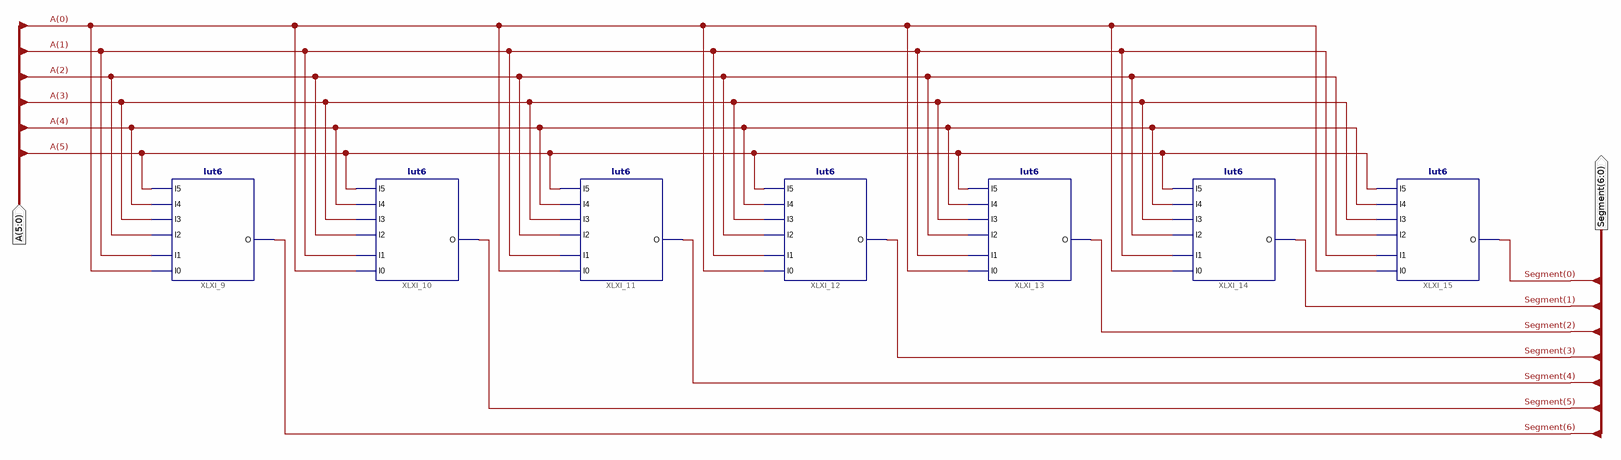
[diagram p0: schematic sheet 1]
// Xilinx ISE schematic ssd1da9tb.sch (spartan6) as structural Verilog: 7 symbols, 2 ports
module ssd1da9tb (
  input  [5:0] A,
  output [6:0] Segment
);

  lut6 #(.INIT("0000000DF38D84FB")) XLXI_9 (
    .O(Segment[6]), .I0(A[0]), .I1(A[1]), .I2(A[2]), .I3(A[3]), .I5(A[5]), .I4(A[4]));
  lut6 #(.INIT("0000000DC55FECF7")) XLXI_10 (
    .O(Segment[5]), .I0(A[0]), .I1(A[1]), .I2(A[2]), .I3(A[3]), .I5(A[5]), .I4(A[4]));
  lut6 #(.INIT("00000005163AFCBF")) XLXI_11 (
    .O(Segment[4]), .I0(A[0]), .I1(A[1]), .I2(A[2]), .I3(A[3]), .I5(A[5]), .I4(A[4]));
  lut6 #(.INIT("0000000DB77C4A5E")) XLXI_12 (
    .O(Segment[3]), .I0(A[0]), .I1(A[1]), .I2(A[2]), .I3(A[3]), .I5(A[5]), .I4(A[4]));
  lut6 #(.INIT("0000000FEDB573CB")) XLXI_13 (
    .O(Segment[2]), .I0(A[0]), .I1(A[1]), .I2(A[2]), .I3(A[3]), .I5(A[5]), .I4(A[4]));
  lut6 #(.INIT("0000000E7FD1E3C9")) XLXI_14 (
    .O(Segment[1]), .I0(A[0]), .I1(A[1]), .I2(A[2]), .I3(A[3]), .I5(A[5]), .I4(A[4]));
  lut6 #(.INIT("0000000FB607F075")) XLXI_15 (
    .O(Segment[0]), .I0(A[0]), .I1(A[1]), .I2(A[2]), .I3(A[3]), .I5(A[5]), .I4(A[4]));
endmodule
